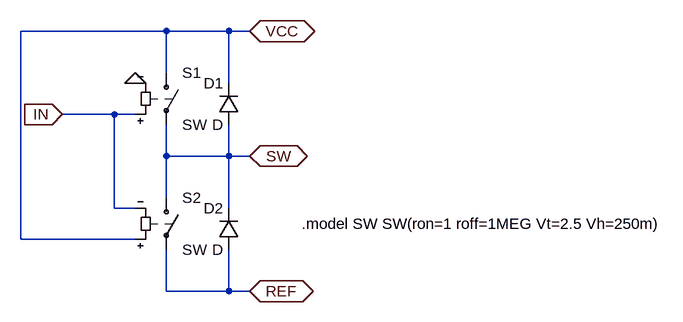
[diagram p0: schematic HBDRV2.asc]
HBDRV2.asc, the LTspice schematic file:
Version 4
SHEET 1 996 680
WIRE 224 64 0 64
WIRE 320 64 224 64
WIRE 352 64 320 64
WIRE 224 128 224 64
WIRE 320 144 320 64
WIRE 144 192 64 192
WIRE 176 192 144 192
WIRE 224 256 224 208
WIRE 320 256 320 208
WIRE 320 256 224 256
WIRE 352 256 320 256
WIRE 224 320 224 256
WIRE 144 336 144 192
WIRE 176 336 144 336
WIRE 320 336 320 256
WIRE 0 384 0 64
WIRE 176 384 0 384
WIRE 224 464 224 400
WIRE 320 464 320 400
WIRE 320 464 224 464
WIRE 352 464 320 464
FLAG 352 256 SW
IOPIN 352 256 BiDir
FLAG 352 64 VCC
IOPIN 352 64 BiDir
FLAG 352 464 REF
IOPIN 352 464 BiDir
FLAG 176 144 0
FLAG 64 192 IN
IOPIN 64 192 In
SYMBOL sw 224 112 R0
SYMATTR InstName S1
SYMBOL sw 224 304 R0
SYMATTR InstName S2
SYMBOL diode 336 208 R180
WINDOW 0 24 64 Left 2
WINDOW 3 24 0 Left 2
SYMATTR InstName D1
SYMBOL diode 336 400 R180
WINDOW 0 24 64 Left 2
WINDOW 3 24 0 Left 2
SYMATTR InstName D2
TEXT 432 360 Left 2 !.model SW SW(ron=1 roff=1MEG Vt=2.5 Vh=250m)

The netlist it stands for:
* HBDRV2.asc
S1 VCC SW IN 0 SW
S2 SW REF VCC IN SW
D1 SW VCC D
D2 REF SW D
.model D D
.lib standard.dio
.model SW SW(ron=1 roff=1MEG Vt=2.5 Vh=250m)
.backanno
.end